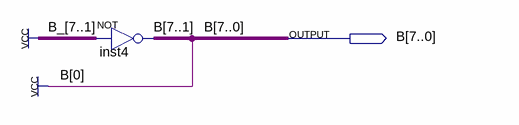
[diagram p0: schematic sheet]
// Quartus schematic CONST3.bdf as structural Verilog: 1 symbols, 1 pins
module CONST3 (
  output [7:0] B
);

  assign B[7:1] = ~{7{1'b1}};  // NOT inst4, 7 bits wide

  assign B[0] = 1'b1;
endmodule
